# EAGLE design OhBaby10-1 (EAGLE 9.4.2)
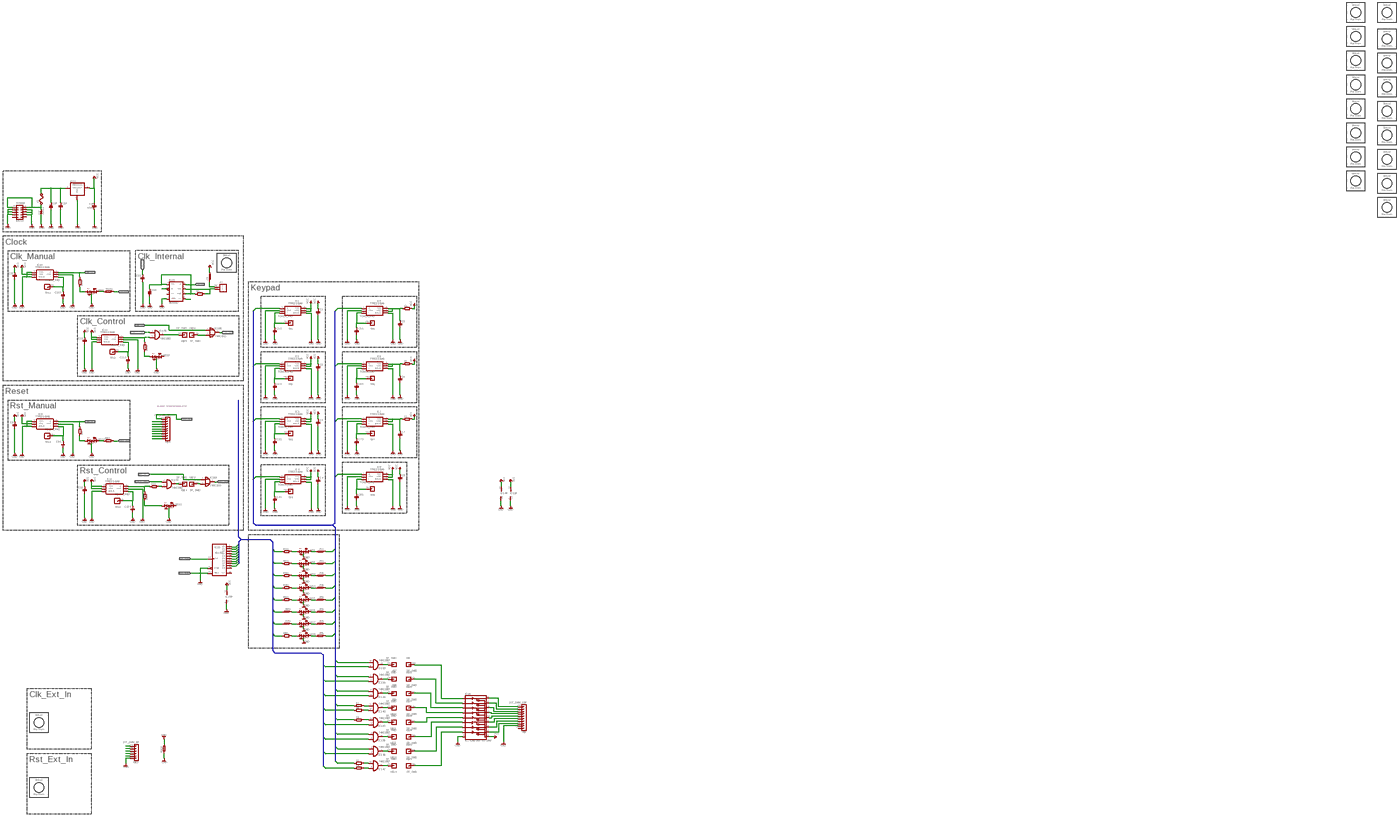
[diagram p0: schematic, sheet 1, overview]
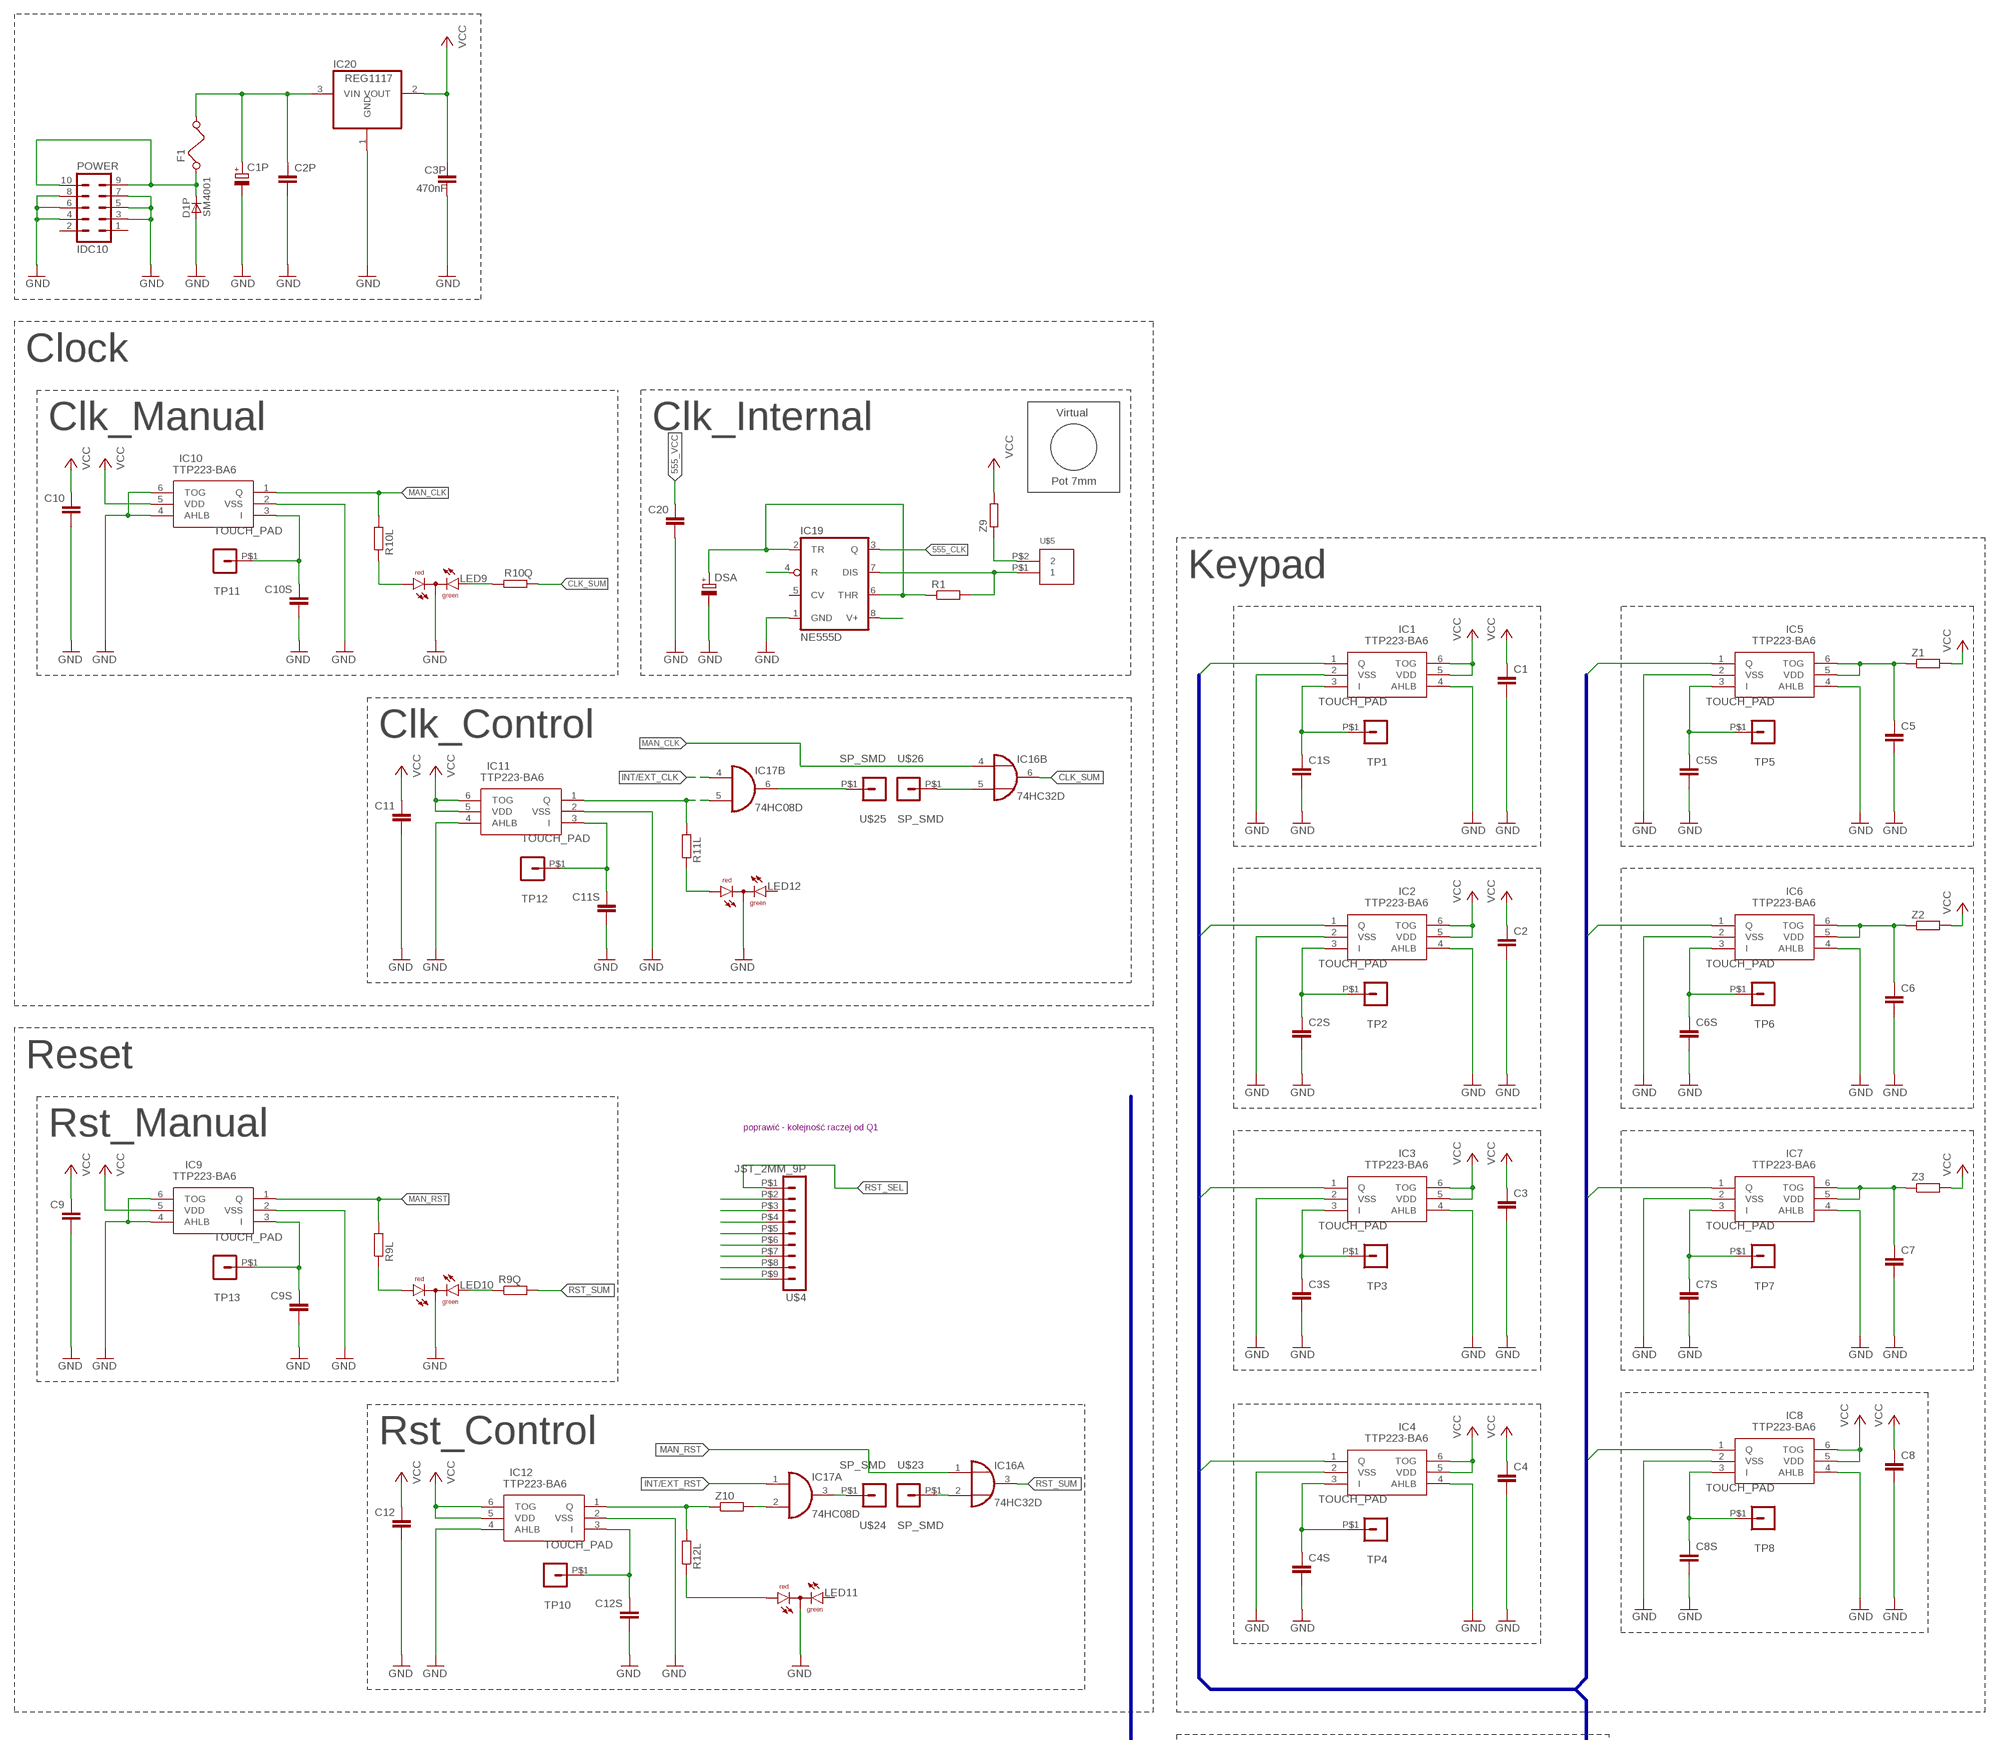
[diagram p1: schematic, sheet 1, part 1 of 5]
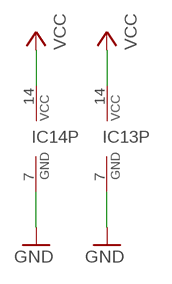
[diagram p2: schematic, sheet 1, part 2 of 5]
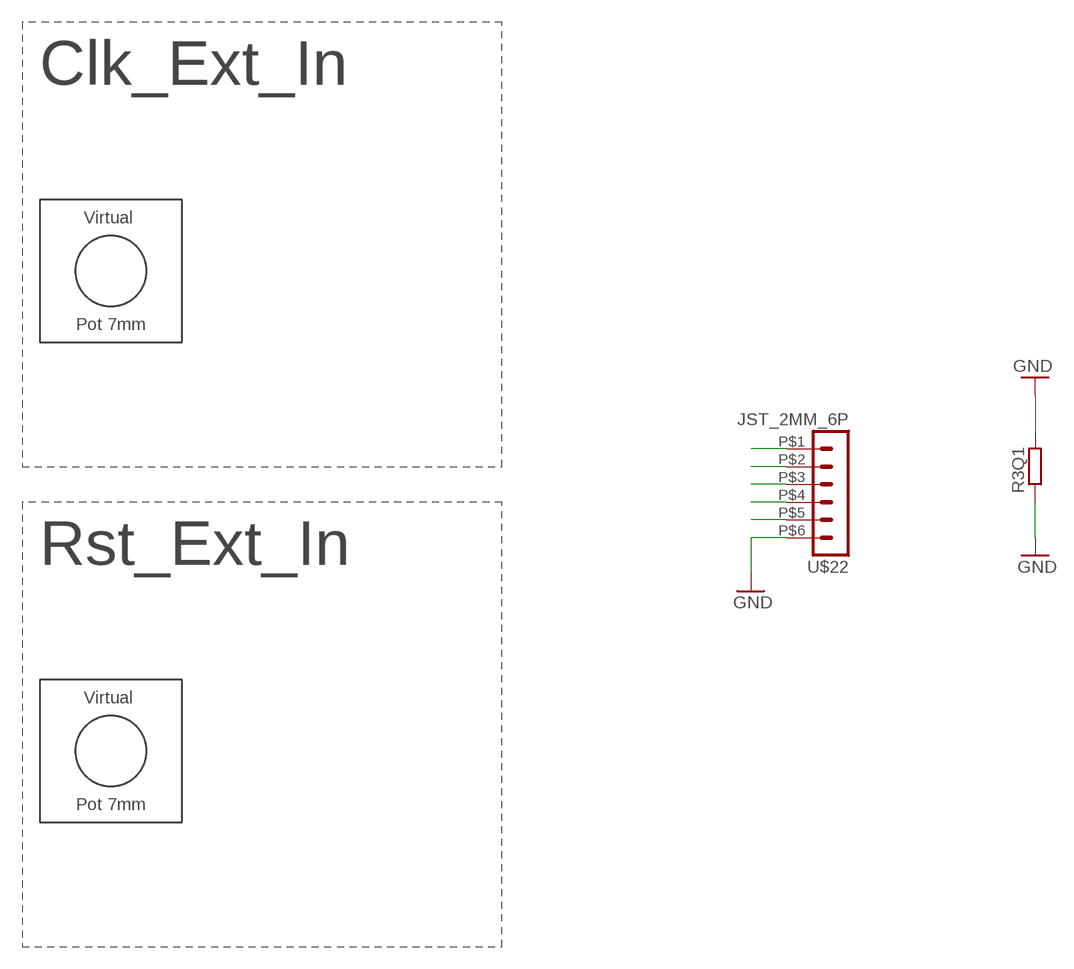
[diagram p3: schematic, sheet 1, part 3 of 5]
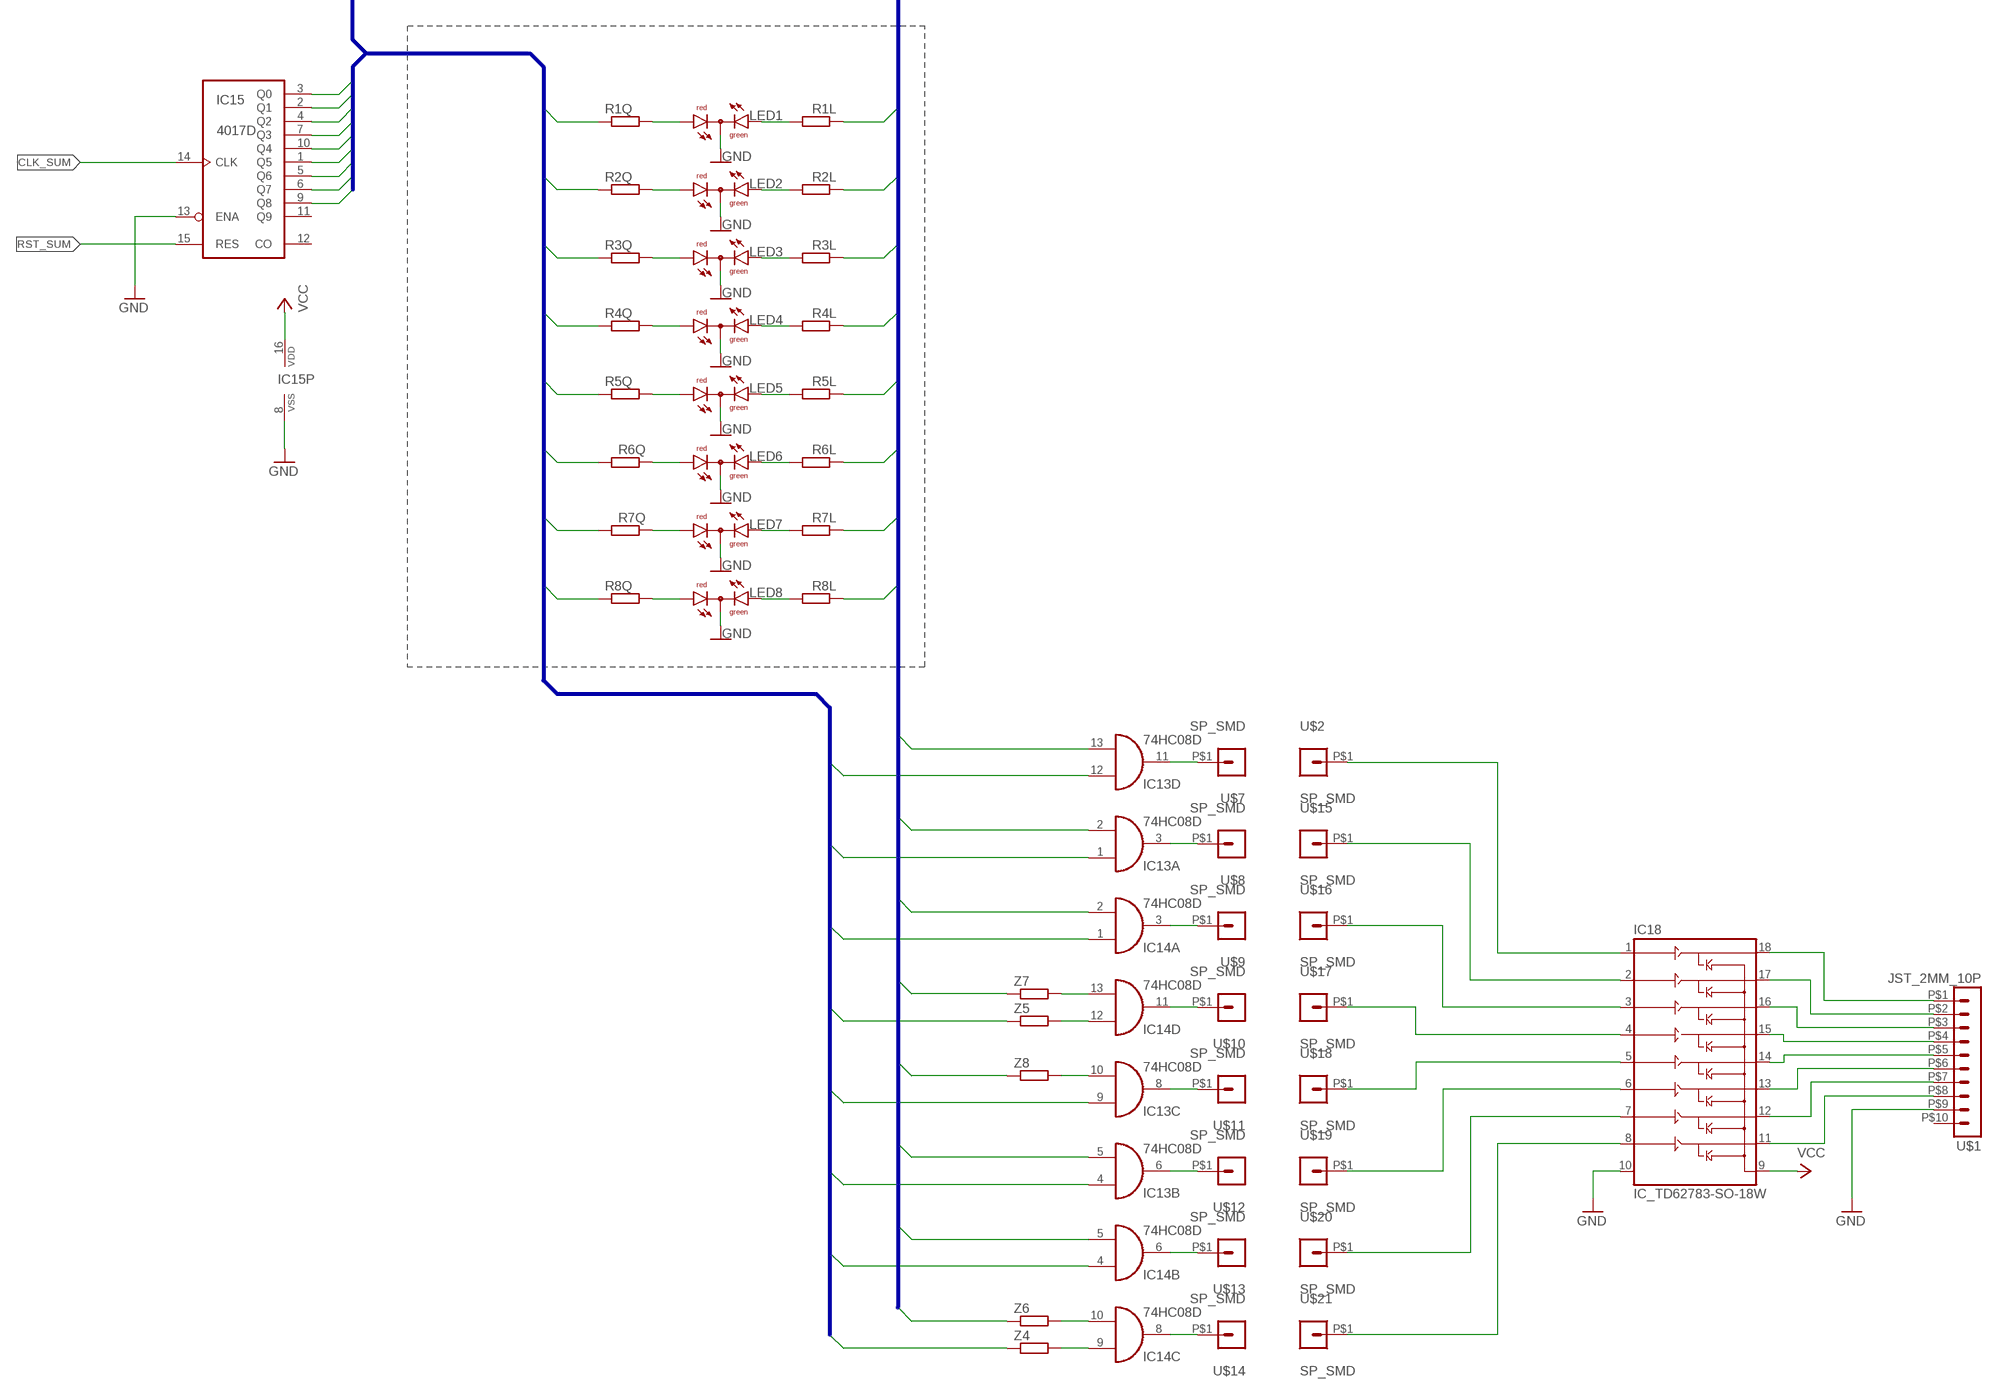
[diagram p4: schematic, sheet 1, part 4 of 5]
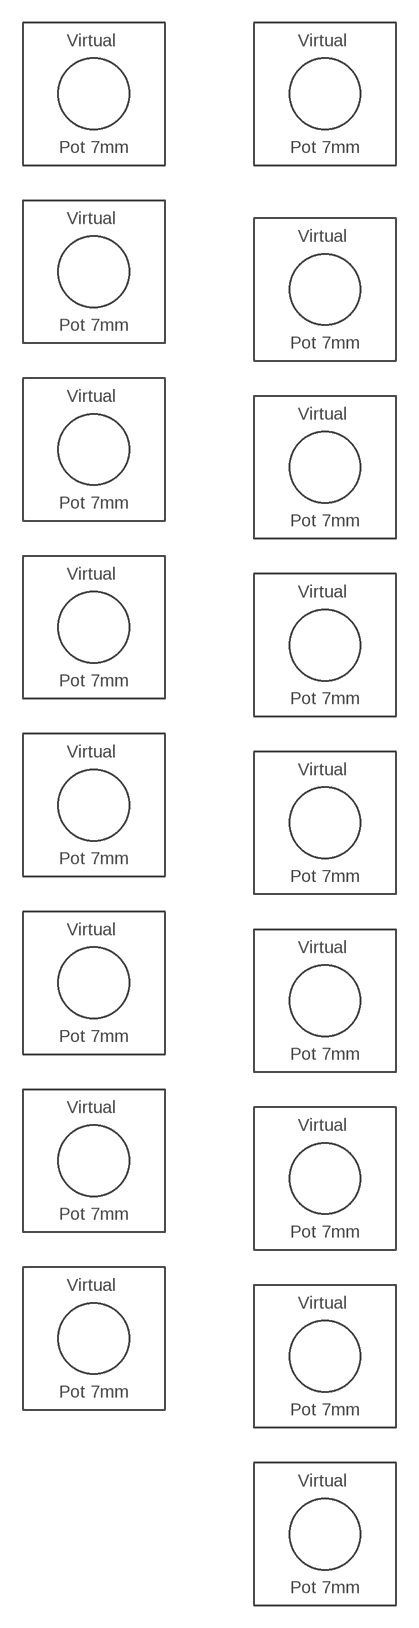
[diagram p5: schematic, sheet 1, part 5 of 5]

## Parts
C1  C-EUC0805  [C0805]
C1P  CPOL-EU153CLV-0405  [153CLV-0405]
C1S  C-EUC0805  [C0805]
C2  C-EUC0805  [C0805]
C2P  C-EUC0805K  [C0805K]
C2S  C-EUC0805  [C0805]
C3  C-EUC0805  [C0805]
C3P  470nF  C-EUC0805  [C0805]
C3S  C-EUC0805  [C0805]
C4  C-EUC0805  [C0805]
C4S  C-EUC0805  [C0805]
C5  C-EUC0805  [C0805]
C5S  C-EUC0805  [C0805]
C6  C-EUC0805  [C0805]
C6S  C-EUC0805  [C0805]
C7  C-EUC0805  [C0805]
C7S  C-EUC0805  [C0805]
C8  C-EUC0805  [C0805]
C8S  C-EUC0805  [C0805]
C9  C-EUC0805  [C0805]
C9S  C-EUC0805  [C0805]
C10  C-EUC0805  [C0805]
C10S  C-EUC0805  [C0805]
C11  C-EUC0805  [C0805]
C11S  C-EUC0805  [C0805]
C12  C-EUC0805  [C0805]
C12S  C-EUC0805  [C0805]
C20  C-EUC0805  [C0805]
CV_OUT  JACK3.5  [JACK_FANCY]
D1P  SM4001  [MELF-MLL41_DO213AB]
DSA  CPOL-EU153CLV-0405  [153CLV-0405]
EXT_CLK_IN  JACK3.5  [JACK_FANCY]
EXT_CLK_IN1  JACK3.5  [JACK_FANCY]
F1  FUSEB  [0805]
IC1  TTP223-BA6  [SOT95P285X126-6N]
IC2  TTP223-BA6  [SOT95P285X126-6N]
IC3  TTP223-BA6  [SOT95P285X126-6N]
IC4  TTP223-BA6  [SOT95P285X126-6N]
IC5  TTP223-BA6  [SOT95P285X126-6N]
IC6  TTP223-BA6  [SOT95P285X126-6N]
IC7  TTP223-BA6  [SOT95P285X126-6N]
IC8  TTP223-BA6  [SOT95P285X126-6N]
IC9  TTP223-BA6  [SOT95P285X126-6N]
IC10  TTP223-BA6  [SOT95P285X126-6N]
IC11  TTP223-BA6  [SOT95P285X126-6N]
IC12  TTP223-BA6  [SOT95P285X126-6N]
IC13  74HC08D  [SO14]
IC14  74HC08D  [SO14]
IC15  4017D  [SO16]
IC16  74HC32D  [SO14]
IC17  74HC08D  [SO14]
IC18  IC_TD62783-SO-18W  [SO-18L]
IC19  NE555D  [SO08]
IC20  REG1117  [SOT223]
LED1  LED_3PIN  [LED_3PIN_SMD]
LED2  LED_3PIN  [LED_3PIN_SMD]
LED3  LED_3PIN  [LED_3PIN_SMD]
LED4  LED_3PIN  [LED_3PIN_SMD]
LED5  LED_3PIN  [LED_3PIN_SMD]
LED6  LED_3PIN  [LED_3PIN_SMD]
LED7  LED_3PIN  [LED_3PIN_SMD]
LED8  LED_3PIN  [LED_3PIN_SMD]
LED9  LED_3PIN  [LED_3PIN_SMD]
LED10  LED_3PIN  [LED_3PIN_SMD]
LED11  LED_3PIN  [LED_3PIN_SMD]
LED12  LED_3PIN  [LED_3PIN_SMD]
OUT_S1  JACK3.5  [JACK_FANCY]
OUT_S2  JACK3.5  [JACK_FANCY]
OUT_S3  JACK3.5  [JACK_FANCY]
OUT_S4  JACK3.5  [JACK_FANCY]
OUT_S5  JACK3.5  [JACK_FANCY]
OUT_S6  JACK3.5  [JACK_FANCY]
OUT_S7  JACK3.5  [JACK_FANCY]
OUT_S8  JACK3.5  [JACK_FANCY]
POT_S1  V_POT  [POT_FANCY]
POT_S2  V_POT  [POT_FANCY]
POT_S3  V_POT  [POT_FANCY]
POT_S4  V_POT  [POT_FANCY]
POT_S5  V_POT  [POT_FANCY]
POT_S6  V_POT  [POT_FANCY]
POT_S7  V_POT  [POT_FANCY]
POT_S8  V_POT  [POT_FANCY]
POWER  IDC10  [ML10]
R1  R-EU_R1206  [R1206]
R1L  R-EU_R0805  [R0805]
R1Q  R-EU_R1206  [R1206]
R2L  R-EU_R0805  [R0805]
R2Q  R-EU_R1206  [R1206]
R3L  R-EU_R0805  [R0805]
R3Q  R-EU_R1206  [R1206]
R3Q1  R-EU_R1206  [R1206]
R4L  R-EU_R0805  [R0805]
R4Q  R-EU_R1206  [R1206]
R5L  R-EU_R0805  [R0805]
R5Q  R-EU_R1206  [R1206]
R6L  R-EU_R0805  [R0805]
R6Q  R-EU_R0805  [R0805]
R7L  R-EU_R0805  [R0805]
R7Q  R-EU_R0805  [R0805]
R8L  R-EU_R0805  [R0805]
R8Q  R-EU_R1206  [R1206]
R9L  R-EU_R0805  [R0805]
R9Q  R-EU_R1206  [R1206]
R10L  R-EU_R0805  [R0805]
R10Q  R-EU_R0805  [R0805]
R11L  R-EU_R0805  [R0805]
R12L  R-EU_R0805  [R0805]
TP1  TOUCH_PAD  [TOUCH_PAD_8X8]
TP2  TOUCH_PAD  [TOUCH_PAD_8X8]
TP3  TOUCH_PAD  [TOUCH_PAD_8X8]
TP4  TOUCH_PAD  [TOUCH_PAD_8X8]
TP5  TOUCH_PAD  [TOUCH_PAD_8X8]
TP6  TOUCH_PAD  [TOUCH_PAD_8X8]
TP7  TOUCH_PAD  [TOUCH_PAD_8X8]
TP8  TOUCH_PAD  [TOUCH_PAD_8X8]
TP10  TOUCH_PAD  [TOUCH_PAD_8X8]
TP11  TOUCH_PAD  [TOUCH_PAD_8X8]
TP12  TOUCH_PAD  [TOUCH_PAD_8X8]
TP13  TOUCH_PAD  [TOUCH_PAD_8X8]
U$1  JST_2MM_10P  [JST_2MM_10P]
U$2  SP_SMD  [SINGLE_PAD_SMD]
U$4  JST_2MM_9P  [JST_2MM_9P]
U$5  JST_2MM_2P  [JST_2MM_2P]
U$6  V_POT  [POT_FANCY]
U$7  SP_SMD  [SINGLE_PAD_SMD]
U$8  SP_SMD  [SINGLE_PAD_SMD]
U$9  SP_SMD  [SINGLE_PAD_SMD]
U$10  SP_SMD  [SINGLE_PAD_SMD]
U$11  SP_SMD  [SINGLE_PAD_SMD]
U$12  SP_SMD  [SINGLE_PAD_SMD]
U$13  SP_SMD  [SINGLE_PAD_SMD]
U$14  SP_SMD  [SINGLE_PAD_SMD]
U$15  SP_SMD  [SINGLE_PAD_SMD]
U$16  SP_SMD  [SINGLE_PAD_SMD]
U$17  SP_SMD  [SINGLE_PAD_SMD]
U$18  SP_SMD  [SINGLE_PAD_SMD]
U$19  SP_SMD  [SINGLE_PAD_SMD]
U$20  SP_SMD  [SINGLE_PAD_SMD]
U$21  SP_SMD  [SINGLE_PAD_SMD]
U$22  JST_2MM_6P  [JST_2MM_6P]
U$23  SP_SMD  [SINGLE_PAD_SMD]
U$24  SP_SMD  [SINGLE_PAD_SMD]
U$25  SP_SMD  [SINGLE_PAD_SMD]
U$26  SP_SMD  [SINGLE_PAD_SMD]
Z1  R-EU_R1206  [R1206]
Z2  R-EU_R1206  [R1206]
Z3  R-EU_R2010  [R2010]
Z4  R-EU_R2010  [R2010]
Z5  R-EU_R2010  [R2010]
Z6  R-EU_R2010  [R2010]
Z7  R-EU_R2010  [R2010]
Z8  R-EU_R1206  [R1206]
Z9  R-EU_R1206  [R1206]
Z10  R-EU_R2010  [R2010]

## Nets
555_CLK: IC19.3(Q) U$22.P$2
555_VCC: C20.1 IC19.4(R) IC19.8(V+) U$5.P$2 Z9.1
4017_Q0: IC13.12(D:I0) IC15.3(Q0) R1Q.1
4017_Q1: IC13.1(A:I0) IC15.2(Q1) R2Q.1 U$4.P$8
4017_Q2: IC14.1(A:I0) IC15.4(Q2) R3Q.1 U$4.P$7
4017_Q3: IC15.7(Q3) R4Q.1 U$4.P$4 Z5.1
4017_Q4: IC13.9(C:I0) IC15.10(Q4) R5Q.1 U$4.P$3
4017_Q5: IC13.4(B:I0) IC15.1(Q5) R6Q.2 U$4.P$9
4017_Q6: IC14.4(B:I0) IC15.5(Q6) R7Q.2 U$4.P$6
4017_Q7: IC15.6(Q7) R8Q.1 U$4.P$5 Z4.1
4017_Q8: IC15.9(Q8) U$4.P$2
+12V_PWR: D1P.C F1.1 POWER.9 POWER.10
CLK_SUM: IC15.14(CLK) IC16.6(B:O) R10Q.1
GND: C1.2 C1P.- C1S.2 C2.2 C2P.2 C2S.2 C3.2 C3P.2 C3S.2 C4.2 C4S.2 C5.2 C5S.2 C6.2 C6S.2 C7.2 C7S.2 C8.2 C8S.2 C9.2 C9S.2 C10.2 C10S.2 C11.2 C11S.2 C12.2 C12S.2 C20.2 D1P.A DSA.- IC1.2(VSS) IC1.4(AHLB) IC2.2(VSS) IC2.4(AHLB) IC3.2(VSS) IC3.4(AHLB) IC4.2(VSS) IC4.4(AHLB) IC5.2(VSS) IC5.4(AHLB) IC6.2(VSS) IC6.4(AHLB) IC7.2(VSS) IC7.4(AHLB) IC8.2(VSS) IC8.4(AHLB) IC9.2(VSS) IC9.4(AHLB) IC9.6(TOG) IC10.2(VSS) IC10.4(AHLB) IC10.6(TOG) IC11.2(VSS) IC11.4(AHLB) IC12.2(VSS) IC12.4(AHLB) IC13.7(P:GND) IC14.7(P:GND) IC15.8(VSS) IC15.13(ENA) IC18.10(VS) IC19.1(GND) IC20.1(GND) LED1.P$1(C) LED2.P$1(C) LED3.P$1(C) LED4.P$1(C) LED5.P$1(C) LED6.P$1(C) LED7.P$1(C) LED8.P$1(C) LED9.P$1(C) LED10.P$1(C) LED11.P$1(C) LED12.P$1(C) POWER.3 POWER.4 POWER.5 POWER.6 POWER.7 POWER.8 R3Q1.1 R3Q1.2 U$1.P$9 U$22.P$6
INT/EXT_CLK: IC17.4(B:I0) U$22.P$4
INT/EXT_RST: IC17.1(A:I0) U$22.P$3
KEY1: IC1.1(Q) IC13.13(D:I1) R1L.1
KEY2: IC2.1(Q) IC13.2(A:I1) R2L.1
KEY3: IC3.1(Q) IC14.2(A:I1) R3L.1
KEY4: IC4.1(Q) R4L.1 Z7.1
KEY5: IC5.1(Q) R5L.1 Z8.1
KEY6: IC6.1(Q) IC13.5(B:I1) R6L.1
KEY7: IC7.1(Q) IC14.5(B:I1) R7L.1
KEY8: IC8.1(Q) R8L.1 Z6.1
KEY11: IC11.1(Q) IC17.5(B:I1) R11L.2
MAN_CLK: IC10.1(Q) IC16.4(B:I0) R10L.2
MAN_RST: IC9.1(Q) IC16.1(A:I0) R9L.2
N$1: DSA.+ IC19.2(TR) IC19.6(THR) R1.1
N$2: C10S.1 IC10.3(I) TP11.P$1
N$3: IC19.7(DIS) R1.2 U$5.P$1
N$4: LED9.P$2(AR) R10L.1
N$5: C1S.1 IC1.3(I) TP1.P$1
N$6: C11S.1 IC11.3(I) TP12.P$1
N$7: LED12.P$2(AR) R11L.1
N$8: C9S.1 IC9.3(I) TP13.P$1
N$9: LED1.P$2(AR) R1Q.2
N$10: C5S.1 IC5.3(I) TP5.P$1
N$11: IC16.5(B:I1) U$26.P$1
N$12: LED10.P$2(AR) R9L.1
N$13: LED1.P$3(AG) R1L.2
N$14: LED2.P$2(AR) R2Q.2
N$15: LED9.P$3(AG) R10Q.2
N$16: LED2.P$3(AG) R2L.2
N$17: C2S.1 IC2.3(I) TP2.P$1
N$18: IC16.2(A:I1) U$23.P$1
N$19: LED3.P$2(AR) R3Q.2
N$20: LED3.P$3(AG) R3L.2
N$21: C12S.1 IC12.3(I) TP10.P$1
N$22: LED4.P$2(AR) R4Q.2
N$23: LED11.P$2(AR) R12L.1
N$24: LED4.P$3(AG) R4L.2
N$25: LED5.P$2(AR) R5Q.2
N$26: C3S.1 IC3.3(I) TP3.P$1
N$27: LED5.P$3(AG) R5L.2
N$28: LED6.P$2(AR) R6Q.1
N$29: LED6.P$3(AG) R6L.2
N$30: LED7.P$2(AR) R7Q.1
N$31: C4S.1 IC4.3(I) TP4.P$1
N$32: LED7.P$3(AG) R7L.2
N$33: LED8.P$2(AR) R8Q.2
N$34: IC17.3(A:O) U$24.P$1
N$35: IC17.6(B:O) U$25.P$1
N$36: U$22.P$5
N$37: IC17.2(A:I1) Z10.2
N$42: LED8.P$3(AG) R8L.2
N$43: IC18.14(OUT5) U$1.P$5
N$44: IC18.13(OUT6) U$1.P$6
N$45: IC18.12(OUT7) U$1.P$7
N$46: IC18.11(OUT8) U$1.P$8
N$47: IC18.15(OUT4) U$1.P$4
N$48: IC18.16(OUT3) U$1.P$3
N$49: C6S.1 IC6.3(I) TP6.P$1
N$50: IC18.17(OUT2) U$1.P$2
N$51: IC18.18(OUT1) U$1.P$1
N$52: LED10.P$3(AG) R9Q.1
N$53 [power]: C1P.+ C2P.1 F1.2 IC20.3(VIN)
N$54: C7S.1 IC7.3(I) TP7.P$1
N$55: IC13.11(D:O) U$7.P$1
N$56: IC13.3(A:O) U$8.P$1
N$59: C8S.1 IC8.3(I) TP8.P$1
N$60: IC14.3(A:O) U$9.P$1
N$61: IC14.11(D:O) U$10.P$1
N$62: IC13.8(C:O) U$11.P$1
N$63: IC13.6(B:O) U$12.P$1
N$64: IC14.6(B:O) U$13.P$1
N$65: IC14.8(C:O) U$14.P$1
N$67: IC14.9(C:I0) Z4.2
N$68: IC14.10(C:I1) Z6.2
N$69: IC14.12(D:I0) Z5.2
N$70: IC14.13(D:I1) Z7.2
N$71: C5.1 IC5.5(VDD) IC5.6(TOG) Z1.1
N$72: C6.1 IC6.5(VDD) IC6.6(TOG) Z2.1
N$73: C7.1 IC7.5(VDD) IC7.6(TOG) Z3.1
N$74: IC13.10(C:I1) Z8.2
N$75: IC18.1(IN1) U$2.P$1
N$76: IC18.2(IN2) U$15.P$1
N$77: IC18.3(IN3) U$16.P$1
N$78: IC18.4(IN4) U$17.P$1
N$79: IC18.5(IN5) U$18.P$1
N$80: IC18.6(IN6) U$19.P$1
N$81: IC18.7(IN7) U$20.P$1
N$82: IC18.8(IN8) U$21.P$1
RS_EXT_ENABLE: IC12.1(Q) R12L.2 Z10.1
RST_SEL: U$4.P$1 U$22.P$1
RST_SUM: IC15.15(RES) IC16.3(A:O) R9Q.2
VCC: C1.1 C2.1 C3.1 C3P.1 C4.1 C8.1 C9.1 C10.1 C11.1 C12.1 IC1.5(VDD) IC1.6(TOG) IC2.5(VDD) IC2.6(TOG) IC3.5(VDD) IC3.6(TOG) IC4.5(VDD) IC4.6(TOG) IC8.5(VDD) IC8.6(TOG) IC9.5(VDD) IC10.5(VDD) IC11.5(VDD) IC11.6(TOG) IC12.5(VDD) IC12.6(TOG) IC13.14(P:VCC) IC14.14(P:VCC) IC15.16(VDD) IC18.9(GND) IC20.2(VOUT) Z1.2 Z2.2 Z3.2 Z9.2
Unconnected: IC15.11(Q9) IC15.12(CO) IC16.8(C:O) IC16.9(C:I0) IC16.10(C:I1) IC16.11(D:O) IC16.12(D:I0) IC16.13(D:I1) IC17.8(C:O) IC17.9(C:I0) IC17.10(C:I1) IC17.11(D:O) IC17.12(D:I0) IC17.13(D:I1) IC19.5(CV) LED11.P$3(AG) LED12.P$3(AG) POWER.1 POWER.2 U$1.P$10

## Buses
4017_Q[0..9]
KEY[1..10]

## Notes on the sheet
- Clock
- Clk_Manual | Clk_Internal
- Keypad
- Clk_Control
- Reset
- Rst_Manual
- poprawić - kolejność raczej od Q1
- Rst_Control
- Clk_Ext_In
- Rst_Ext_In

## Power pins joined to a net without a drawn wire
GND: IC16.7(P:GND) IC17.7(P:GND)
VCC: IC16.14(P:VCC) IC17.14(P:VCC)

## Library data of the parts
C1 C1S C2 C2P C2S C3 C3P C3S C4 C4S C5 C5S C6 C6S C7 C7S C8 C8S C9 C9S C10 C10S C11 C11S C12 C12S C20 = rcl:C-EU: CAPACITOR, European symbol; SPICEPREFIX: C
C1P DSA = rcl:CPOL-EU: POLARIZED CAPACITOR, European symbol; SPICEPREFIX: C
CV_OUT EXT_CLK_IN EXT_CLK_IN1 OUT_S1-OUT_S8 = custom_jatsekku:JACK3.5
D1P = hhn_diodes_smd:SM400*: SM4001 .. SM4007 General Purpose Rectifier, 1 A SMD-Version of 1N4001 .. 1N4007 Case: MELF-MLL41 = DO 213 AB Author: Dipl.-Ing. FH Rainer Bayer HHN Hochschule Heilbronn, rainer.bayer@hs-heilbronn.de Ingenieurbüro ing-rb, mail@ing-rb.de
F1 = m-pad-2.1:FUSE: Fuse's in various packages
IC1-IC12 = TTP223-BA6:TTP223-BA6: 1 KEY TOUCH PAD DETECTOR IC Source: Datasheet <https://radiokot.ru/konkursCatDay2014/53/01.pdf>; DESCRIPTION: 1 KEY TOUCH PAD DETECTOR IC; HEIGHT: 1.26mm; MANUFACTURER_NAME: TONTEK; MANUFACTURER_PART_NUMBER: TTP223-BA6
IC13 IC14 IC17 = 74xx-eu:74*08: Quad 2-input AND gate
IC15 = 40xx:4017: COUNTER/DIVIDER
IC16 = 74xx-eu:74*32: Quad 2-input OR gate
IC18 = dp_devices:IC_TD62783: 8 Channel High voltage Source driver Mfr no: TD62783 TD62783AFG <http://www.digikey.com/product-detail/en/TD62783AFG%28O,S%29/TD62783AFG%28OS%29-ND/871116>
IC19 = linear:*555: TIMER
IC20 = burr-brown:REG1117: 800mA and 1A Low Dropout (LDO) Positive Regulator 1.8V, 2.5V, 2.85V, 3.3V, 5V, and Adj; MPN: REG1117; OC_FARNELL: 1097566; OC_NEWARK: 14P6981
LED1-LED12 = custom_jatsekku:LED_3PIN
POT_S1-POT_S8 U$6 = custom_jatsekku:V_POT
POWER = custom_jatsekku:IDC10
R1 R1L R1Q R2L R2Q R3L R3Q R3Q1 R4L R4Q R5L R5Q R6L R6Q R7L R7Q R8L R8Q R9L R9Q R10L R10Q R11L R12L Z1-Z10 = rcl:R-EU_: RESISTOR, European symbol; SPICEPREFIX: R
TP1-TP8 TP10-TP13 = custom_jatsekku:TOUCH_PAD
U$1 = custom_jatsekku:JST_2MM_10P
U$2 U$7-U$21 U$23-U$26 = custom_jatsekku:SP_SMD
U$4 = custom_jatsekku:JST_2MM_9P
U$5 = custom_jatsekku:JST_2MM_2P
U$22 = custom_jatsekku:JST_2MM_6P

## Board
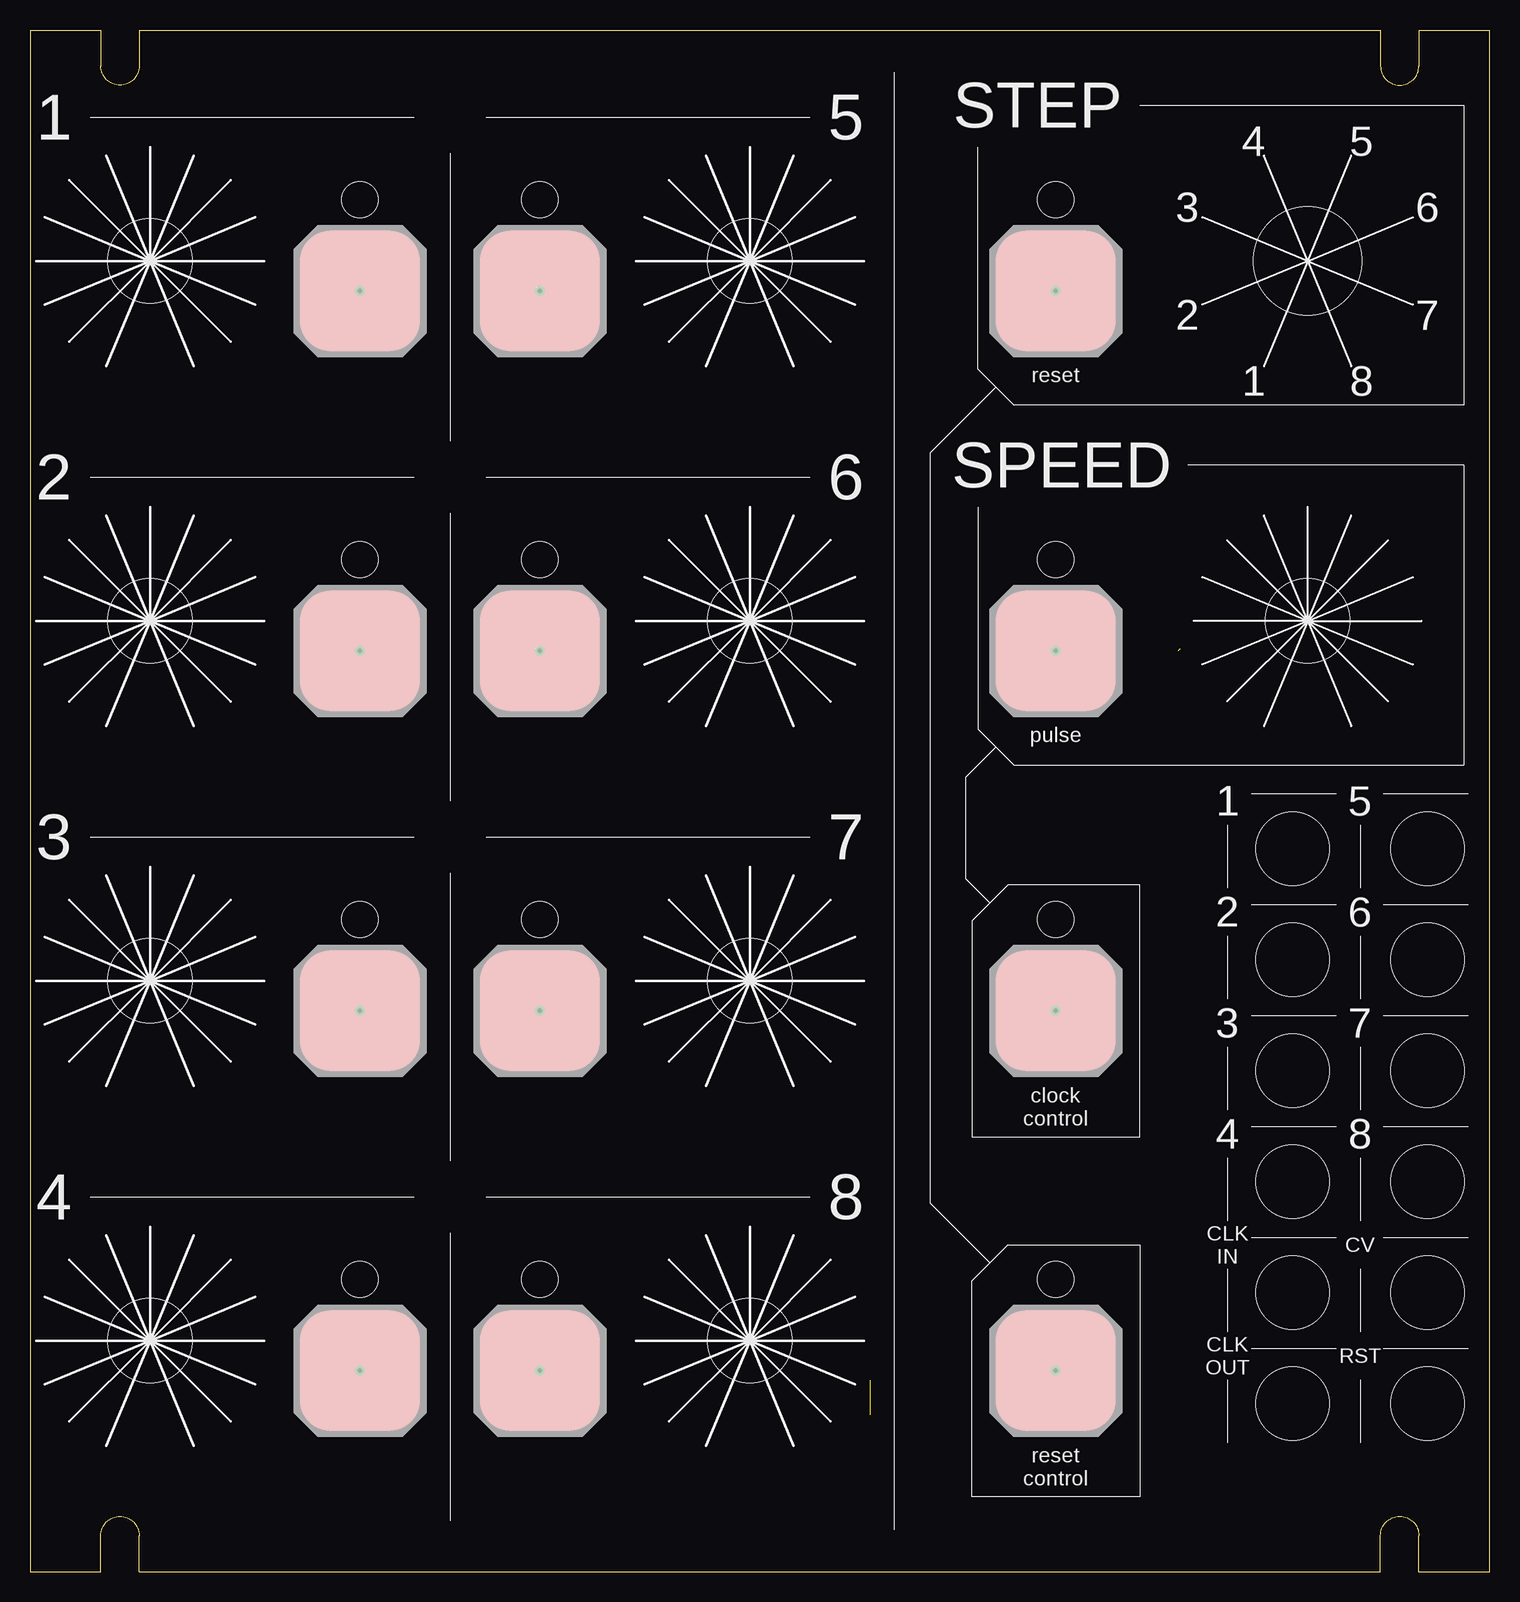
[diagram p6: board, top side]
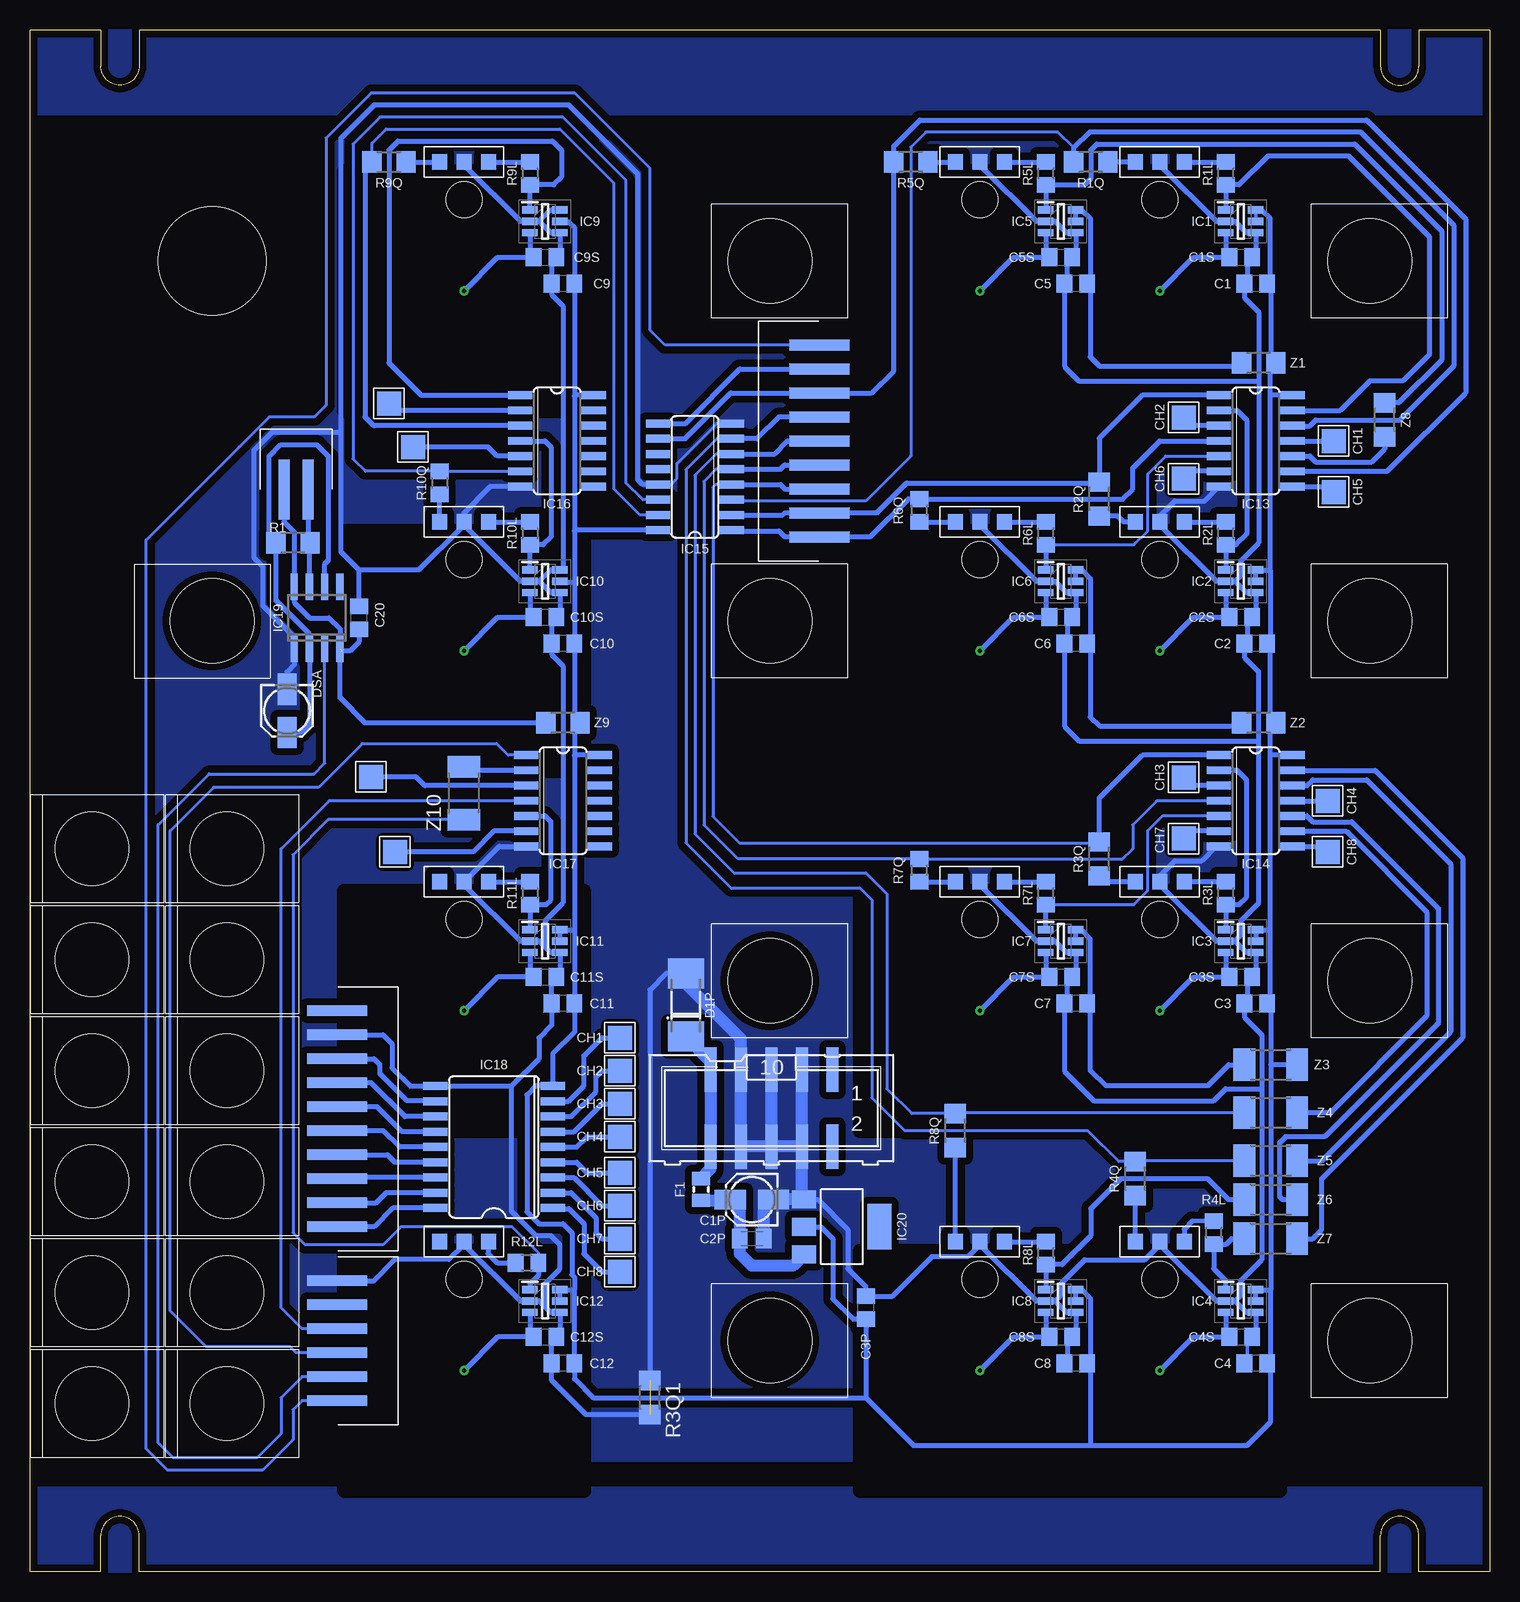
[diagram p7: board, bottom side, seen from below]

Size 121.68 x 128.5 mm. Coordinates in mm from the lower left corner, seen from the top.
Outline: 0,0 5.9,0 5.9,3 arc-180 9.1,3 9.1,0 112.58,0 112.58,3 arc-180 115.78,3 115.78,0 121.68,0 121.68,128.5 115.78,128.5 115.78,125.5 arc-180 112.58,125.5 112.58,128.5 9.1,128.5 9.1,125.5 arc-180 5.9,125.5 5.9,128.5 0,128.5 0,0
Copper layers (1*16): Top 0.035mm / dielectric 1.5mm / Bottom 0.035mm
Design rules "default *": minimum track width 3.5mil, minimum drill 0.2mm, track to track 6mil, track to pad 6mil, pad to pad 6mil, via to via 6mil, smd to smd 6mil, copper to edge 5mil, drill to drill 6mil, minimum pad ring 10mil, minimum via ring 8mil, stop-mask expansion 4mil, vias tented up to drill 0mil, thermal gap 10mil
Holes 3 mm at 27.5,114.35 42.5,114.35 27.5,84.35 42.5,84.35 27.5,54.35 42.5,54.35 27.5,24.35 42.5,24.35 85.5,84.35 85.5,114.35 85.5,54.35 85.5,24.35
Holes 9 mm at 106.5,109.25
bRestrict: area 17.5,96.8 to 52.5,116.8; area 17.5,66.8 to 52.5,86.8; area 17.5,36.8 to 52.5,56.8; area 17.5,6.8 to 52.5,26.8; area 75.5,96.8 to 95.5,116.8; area 75.5,66.8 to 95.5,86.8; area 75.5,36.8 to 95.5,56.8; area 75.5,6.8 to 95.5,26.8

### Footprints (pad centres in the part's own frame; a part is rotated, then mirrored left to right if it is on the bottom)
C0805 = smd 1.3 x 1.5: 1 -0.95,0; 2 0.95,0
153CLV-0405 = smd 2.6 x 1.6: + 1.8,0; - -1.8,0
C0805K = smd 1.3 x 1.6: 1 -1,0; 2 1,0
JACK_FANCY = hole 6.1: 0,0
MELF-MLL41_DO213AB = smd 2.5 x 3: A 2.625,0; C -2.625,0
0805 = smd 1.1 x 1.5: 1 -0.9,0; 2 0.9,0
SOT95P285X126-6N = smd 1.3 x 0.6: 1 -1.25,0.95; 2 -1.25,0; 3 -1.25,-0.95; 4 1.25,-0.95; 5 1.25,0; 6 1.25,0.95
SO14 = smd 0.66 x 2.032: 1 -3.81,-3.073; 2 -2.54,-3.073; 3 -1.27,-3.073; 4 0,-3.073; 5 1.27,-3.073; 6 2.54,-3.073; 7 3.81,-3.073; 8 3.81,3.073; 9 2.54,3.073; 10 1.27,3.073; 11 0,3.073; 12 -1.27,3.073; 13 -2.54,3.073; 14 -3.81,3.073
SO16 = smd 0.66 x 2.032: 1 -4.445,-3.073; 2 -3.175,-3.073; 3 -1.905,-3.073; 4 -0.635,-3.073; 5 0.635,-3.073; 6 1.905,-3.073; 7 3.175,-3.073; 8 4.445,-3.073; 9 4.445,3.073; 10 3.175,3.073; 11 1.905,3.073; 12 0.635,3.073; 13 -0.635,3.073; 14 -1.905,3.073; 15 -3.175,3.073; 16 -4.445,3.073
SO-18L = smd 0.66 x 2.032: 1 -4.445,-4.902; 2 -3.175,-4.902; 3 -1.905,-4.902; 4 -0.635,-4.902; 5 0.635,-4.902; 6 1.905,-4.902; 7 3.175,-4.902; 8 4.445,-4.902; 9 5.715,-4.902; 10 5.715,4.902; 11 4.445,4.902; 12 3.175,4.902; 13 1.905,4.902; 14 0.635,4.902; 15 -0.635,4.902; 16 -1.905,4.902; 17 -3.175,4.902; 18 -4.445,4.902
SO08 = smd 0.6 x 2.2: 1 -1.905,-2.6; 2 -0.635,-2.6; 3 0.635,-2.6; 4 1.905,-2.6; 5 1.905,2.6; 6 0.635,2.6; 7 -0.635,2.6; 8 -1.905,2.6
SOT223 = smd 1.499 x 2.007: 1 -2.261,-3.15; 2 0.025,-3.15; 3 2.311,-3.15 | smd 3.81 x 2.007: 4 0,3.15
LED_3PIN_SMD = smd 1.27 x 1.27: P$1 0,0; P$2 -2.04,0; P$3 2.04,0
POT_FANCY = hole 7: 0,0
ML10 = smd 1.02 x 3.7: 1 -5.08,-3.2; 2 -5.08,3.2; 3 -2.54,-3.2; 4 -2.54,3.2; 5 0,-3.2; 6 0,3.2; 7 2.54,-3.2; 8 2.54,3.2; 9 5.08,-3.2; 10 5.08,3.2
R1206 = smd 1.6 x 1.803: 1 -1.422,0; 2 1.422,0
R0805 = smd 1.3 x 1.5: 1 -0.95,0; 2 0.95,0
TOUCH_PAD_8X8 = smd 10 x 10: P$1 0,0
JST_2MM_10P = smd 0.914 x 5: P$1 -9,5.08; P$2 -7,5.08; P$3 -5,5.08; P$4 -3,5.08; P$5 -1,5.08; P$6 1,5.08; P$7 3,5.08; P$8 5,5.08; P$9 7,5.08; P$10 9,5.08
SINGLE_PAD_SMD = smd 2 x 2: P$1 0,0
JST_2MM_9P = smd 0.914 x 5: P$1 -7.73,5.08; P$2 -5.73,5.08; P$3 -3.73,5.08; P$4 -1.73,5.08; P$5 0.27,5.08; P$6 2.27,5.08; P$7 4.27,5.08; P$8 6.27,5.08; P$9 8.27,5.08
JST_2MM_2P = smd 0.914 x 5: P$1 -1,5.08; P$2 1,5.08
JST_2MM_6P = smd 0.914 x 5: P$1 -5,5.08; P$2 -3,5.08; P$3 -1,5.08; P$4 1,5.08; P$5 3,5.08; P$6 5,5.08
R2010 = smd 1.8 x 2.7: 1 -2.2,0; 2 2.2,0

### Placement (x,y rotation side)
C1  19.5,107.35 180 bottom
C1P  61.5,31 180 bottom
C1S  20.75,109.55 0 bottom
C2  19.5,77.35 180 bottom
C2P  61.5,27.75 0 bottom
C2S  20.75,79.55 0 bottom
C3  19.5,47.35 180 bottom
C3P  52,22 90 bottom
C3S  20.75,49.55 0 bottom
C4  19.5,17.35 180 bottom
C4S  20.75,19.55 0 bottom
C5  34.5,107.35 180 bottom
C5S  35.75,109.55 0 bottom
C6  34.5,77.35 180 bottom
C6S  35.75,79.55 0 bottom
C7  34.5,47.35 180 bottom
C7S  35.75,49.55 0 bottom
C8  34.5,17.35 180 bottom
C8S  35.75,19.55 0 bottom
C9  77.25,107.35 180 bottom
C9S  78.75,109.55 0 bottom
C10  77.25,77.35 180 bottom
C10S  78.75,79.55 0 bottom
C11  77.25,47.35 180 bottom
C11S  78.75,49.55 0 bottom
C12  77.25,17.35 180 bottom
C12S  78.75,19.55 0 bottom
C20  94.25,79.5 90 bottom
CV_OUT  105.25,23.25 90 bottom
D1P  67,47.21 90 bottom
DSA  100.25,71.75 270 bottom
EXT_CLK_IN  116.5,23.25 90 bottom
EXT_CLK_IN1  105.25,14 90 bottom
F1  65.75,31.85 270 bottom
IC1  20.75,112.55 0 bottom
IC2  20.75,82.55 0 bottom
IC3  20.75,52.55 0 bottom
IC4  20.75,22.55 0 bottom
IC5  35.75,112.55 0 bottom
IC6  35.75,82.55 0 bottom
IC7  35.75,52.55 0 bottom
IC8  35.75,22.55 0 bottom
IC9  78.75,112.55 0 bottom
IC10  78.75,82.55 0 bottom
IC11  78.75,52.55 0 bottom
IC12  78.75,22.55 0 bottom
IC13  19.5,94.25 270 bottom
IC14  19.5,64.25 270 bottom
IC15  66.25,91.25 90 bottom
IC16  77.75,94.25 270 bottom
IC17  77.25,64.25 270 bottom
IC18  83,34.75 90 bottom
IC19  97.75,79.5 0 bottom
IC20  54,28.75 270 bottom
LED1  27.5,117.5 0 bottom
LED2  27.5,87.5 0 bottom
LED3  27.5,57.5 0 bottom
LED4  27.5,27.5 0 bottom
LED5  42.5,117.5 0 bottom
LED6  42.5,87.5 0 bottom
LED7  42.5,57.5 0 bottom
LED8  42.5,27.5 0 bottom
LED9  85.5,87.5 180 bottom
LED10  85.5,117.5 180 bottom
LED11  85.5,27.5 180 bottom
LED12  85.5,57.5 180 bottom
OUT_S1  105.25,60.25 90 bottom
OUT_S2  105.25,51 90 bottom
OUT_S3  105.25,41.75 90 bottom
OUT_S4  105.25,32.5 90 bottom
OUT_S5  116.5,60.25 90 bottom
OUT_S6  116.5,51 90 bottom
OUT_S7  116.5,41.75 90 bottom
OUT_S8  116.5,32.5 90 bottom
POT_S1  10,109.25 90 bottom
POT_S2  10,79.25 90 bottom
POT_S3  10,49.25 90 bottom
POT_S4  60,109.25 90 bottom
POT_S5  60,79.25 90 bottom
POT_S6  60,49.25 90 bottom
POT_S7  60,19.25 90 bottom
POT_S8  10,19.25 90 bottom
POWER  59.88,38.62 180 bottom
R1  99.75,85.75 0 bottom
R1L  22,116.55 90 bottom
R1Q  33.25,117.5 0 bottom
R2L  22,86.55 90 bottom
R2Q  32.54,89.39 270 bottom
R3L  22,56.55 90 bottom
R3Q  32.54,59.4 270 bottom
R3Q1  70,14.5 270 bottom
R4L  23,28.25 90 bottom
R4Q  29.54,32.75 270 bottom
R5L  37,116.55 90 bottom
R5Q  48.25,117.5 0 bottom
R6L  37,86.55 90 bottom
R6Q  47.54,88.45 90 bottom
R7L  37,56.55 90 bottom
R7Q  47.54,58.45 90 bottom
R8L  37,26.55 90 bottom
R8Q  44.54,36.75 270 bottom
R9L  80,116.55 270 bottom
R9Q  91.75,117.5 180 bottom
R10L  80,86.55 270 bottom
R10Q  87.54,90.75 270 bottom
R11L  80,56.55 270 bottom
R12L  80.25,25.75 0 bottom
TP1  27.5,106.75 0 top
TP2  27.5,76.75 0 top
TP3  27.5,46.75 0 top
TP4  27.5,16.75 0 top
TP5  42.5,106.75 0 top
TP6  42.5,76.75 0 top
TP7  42.5,46.75 0 top
TP8  42.5,16.75 0 top
TP10  85.5,16.75 0 top
TP11  85.5,76.75 0 top
TP12  85.5,46.75 0 top
TP13  85.5,106.75 0 top
U$1  91,37.75 90 bottom
U$2  72.5,25 180 bottom
U$3  JACK3.5  [JACK_FANCY]  116.5,14 90 bottom
U$4  60.96,94.5 270 bottom
U$5  99.5,95.25 180 bottom
U$6  106.5,79.25 270 bottom
U$7  13,94.25 0 bottom
U$8  25.5,96.2 0 bottom
U$9  25.5,66.2 0 bottom
U$10  13.5,64.25 0 bottom
U$11  13,90 0 bottom
U$12  25.5,91.1 0 bottom
U$13  25.5,61.1 0 bottom
U$14  13.5,60 0 bottom
U$15  72.5,27.75 180 bottom
U$16  72.5,30.5 180 bottom
U$17  72.5,33.25 180 bottom
U$18  72.5,36.25 180 bottom
U$19  72.5,39 180 bottom
U$20  72.5,41.75 180 bottom
U$21  72.5,44.5 180 bottom
U$22  91,19.25 90 bottom
U$23  91.75,97.38 0 bottom
U$24  93.25,66.25 0 bottom
U$25  91.25,60 0 bottom
U$26  89.75,93.75 0 bottom
Z1  19.25,100.75 0 bottom
Z2  19.25,70.75 0 bottom
Z3  18.25,42.25 0 bottom
Z4  18.25,38.25 0 bottom
Z5  18.25,34.25 0 bottom
Z6  18.25,31 0 bottom
Z7  18.25,27.75 0 bottom
Z8  8.75,96 270 bottom
Z9  77.25,70.75 0 bottom
Z10  85.5,64.88 90 bottom

### Tracks (layer width: path | path; a pad name or v marks a point on that pad's centre or on a via)
555_CLK
  Bottom 0.254: U$22.P$2 99,16.25 100.75,14.5 100.75,11.5 102.75,9.5 109.75,9.5 111,10.75 111,62.25 106.75,66.5 98,66.5 97.11,67.39 IC19.3
555_VCC  (1 unrouted)
  Bottom 0.406: U$5.P$2 100.41,90.08 100.5,89.98 100.5,87.5 99.66,86.66 IC19.8 99.66,80.78 98.37,79.5 96.75,79.5 95.84,78.59 IC19.4 95.84,72.84 93.75,70.75 Z9.1 | C20.1 94.25,77.5 95,76.75 95.69,76.75
4017_Q0
  Bottom 0.254: 34.67,118.67 36,120 47,120 48.25,118.75 48.25,93 52,89.25 63.08,89.25
  Bottom 0.406: R1Q.1 34.67,118.67 33.34,120 10.75,120 3,112.25 3,100.5 7.5,96 14.5,96 15,95.5 16.41,95.5 IC13.12 | 63.08,89.25 IC15.3
4017_Q1
  Bottom 0.254: 58.92,88.08 58.75,88.25
  Bottom 0.406: IC13.1 28.94,98.06 32.54,94.46 R2Q.1 32.61,90.75 48.61,90.75 51.13,88.23 U$4.P$8 55.9,88.25 58.75,88.25 | IC15.2 58.92,88.08
4017_Q2
  Bottom 0.254: 32.61,60.75 62.55,60.75 64.75,62.95 64.75,90.38 64.52,90.61 IC15.4
  Bottom 0.406: IC14.1 28.94,68.06 32.54,64.46 R3Q.1 32.61,60.75 | IC15.4 59.12,90.61 58.75,90.25 55.9,90.25 U$4.P$7
4017_Q3
  Bottom 0.152: U$4.P$4 55.27,96.23 55.25,96.25
  Bottom 0.254: Z5.1 29.46,34.25 | R4Q.1 30.92,34.17 33.5,36.75 48.75,36.75 51.5,39.5 51.5,56 52.5,57 63.25,57 67,60.75 67,91.84 64.41,94.42 IC15.7
  Bottom 0.406: 29.46,34.25 R4Q.1 | 55.25,96.25 59.25,96.25 61.08,94.42 IC15.7
4017_Q4
  Bottom 0.406: IC13.9 8.54,91.71 2,98.25 2,112.75 10.25,121 47.5,121 49.67,118.83 R5Q.1 49.67,100.08 51.52,98.23 U$4.P$3 63.27,98.23 67.08,94.42 IC15.10
4017_Q5
  Bottom 0.406: IC13.4 27.5,94.25 29.75,92 29.75,90.25 30.61,89.39 R6Q.2 48.47,89.4 51.64,86.23 U$4.P$9 58.73,86.23 59.25,86.75 63.12,86.75 IC15.1
4017_Q6
  Bottom 0.254: IC14.4 27.75,64.25 29.75,62.25 29.75,60.25 30.6,59.4 R7Q.2 62.65,59.4 65.5,62.25 65.5,90.87 64.48,91.89 IC15.5
  Bottom 0.406: IC15.5 59.12,91.89 58.77,92.23 U$4.P$6
4017_Q7
  Bottom 0.254: Z4.1 44.46,38.25 | R8Q.1 48.17,38.17 50.25,40.25 50.25,56.5 52,58.25 63,58.25 66.25,61.5 66.25,91.38 64.47,93.16 IC15.6
  Bottom 0.406: 44.46,38.25 R8Q.1 | IC15.6 59.59,93.16 58.52,94.23 U$4.P$5
4017_Q8
  Bottom 0.406: IC15.9 67.06,95.69 62.52,100.23 U$4.P$2
+12V_PWR
  Bottom 0.406: 64.95,33.55 POWER.10
  Bottom 1.016: F1.1 64.95,33.55 | POWER.10 POWER.9 64.95,42.54 D1P.C
CLK_SUM
  Bottom 0.254: 87.51,91.71 IC16.6 | IC15.14 70.59,89.34 72,90.75 72,116 77.25,121.25 92.5,121.25 94.75,119 94.75,92.75 93.71,91.71 87.51,91.71 | R10Q.1 87.51,91.71
GND  (1 unrouted)
  Bottom 0.152: 19.5,49.85 C3S.2
  Bottom 0.203: LED1.P$1 27.5,117.25
  Bottom 0.254: IC15.8 64.43,95.69 67.75,92.38 67.75,91.12 68.26,90.61 IC15.13
  Bottom 0.305: C4.2 20.19,17.55 20.19,19.25 19.95,19.55 C4S.2
  Bottom 0.406: 21.23,82.55 20.28,81.6 IC2.4 19.5,79.75 19.7,79.55 C2S.2 20.19,79.16 20.19,77.61 C2.2 20.45,76.2 19.25,75 19.25,69.25 | 21.23,82.55 IC2.2 22.8,82.55 27.5,87.25 LED2.P$1 27.5,88 26.25,89.25 23.75,89.25 22.57,90.43 IC13.7 | 21.23,52.55 20.28,51.6 IC3.4 19.5,49.85 | 21.23,52.55 IC3.2 22.8,52.55 27.5,57.25 LED3.P$1 27.5,58 26.25,59.25 24,59.25 22.81,60.44 IC14.7 22.97,60.34 | 21.23,22.55 20.28,21.6 IC4.4 19.5,19.85 C4S.2 | 21.23,22.55 IC4.2 22.8,22.55 27.5,27.25 | 27.5,117.25 22.8,112.55 IC1.2 21.23,112.55 20.28,111.6 IC1.4 19.5,109.85 C1S.2 20.19,109.16 20.19,107.61 C1.2 20.45,106.2 19.25,105 19.25,99.25 | 42.5,27.25 37.8,22.55 IC8.2 36.23,22.55 | 42.5,27.25 LED8.P$1 | 36.23,22.55 35.28,21.6 IC8.4 34.5,19.85 C8S.2 35.19,19.15 35.19,17.95 35,17.75 35.4,17.35 C8.2 | LED7.P$1 42.5,57.25 37.8,52.55 IC7.2 36.23,52.55 35.28,51.6 IC7.4 34.5,49.85 C7S.2 35.19,49.15 35.19,47.6 C7.2 35.45,41.7 33,39.25 23,39.25 22,40.25 19,40.25 | LED6.P$1 42.5,87.25 37.8,82.55 IC6.2 36.23,82.55 35.28,81.6 IC6.4 34.5,79.85 C6S.2 35.17,79.17 | LED5.P$1 42.5,117.25 37.8,112.55 IC5.2 36.23,112.55 35.28,111.6 IC5.4 34.5,109.83 34.65,109.68 | 34.5,109.8 34.65,109.68 | 34.65,109.68 C5S.2 35.19,109.17 | 35.19,109.17 35.2,109.15 | 35.17,79.17 35.2,79.15 | LED10.P$1 85.5,117.25 80.8,112.55 IC9.2 79.23,112.55 | 79.23,112.55 78.28,111.6 IC9.4 77.5,110.05 C9S.2 78.2,109.35 C9.2 78.2,106.45 77.25,105.5 77.25,83.75 IC10.6 78.28,83.5 79.23,82.55 | IC9.6 78.28,113.5 79.23,112.55 | 79.23,82.55 78.28,81.6 IC10.4 77.5,79.85 C10S.2 78.2,79.15 C10.2 78.2,76.45 77.25,75.5 77.25,55.75 78.71,54.28 78.71,52.04
  Bottom 0.406: 79.23,82.55 IC10.2 80.81,82.55 85.5,87.24 LED9.P$1 | 19.25,99.25 19.25,85.75 20.75,84.25 20.75,83.03 21.23,82.55 | 21.23,52.55 20.75,53.03 20.75,54.25 19.25,55.75 19.25,69.25 | 21.23,22.55 20.75,23.03 20.75,24.25 19,26 19,40.25 | C3S.2 20.19,49.16 20.19,47.61 C3.2 20.45,46.2 19,44.75 19,40.25 | 78.84,22.16 78.28,21.6 IC12.4 77.5,19.85 C12S.2 78.2,19.15 C12.2 78.2,15.95 75.33,13.08 R3Q1.2 | 78.84,22.16 79.23,22.55 IC12.2 80.8,22.55 85.5,27.25 LED11.P$1 | 78.71,52.04 78.28,51.6 IC11.4 77.5,49.85 C11S.2 78.2,49.15 C11.2 78.2,45.55 79.25,44.5 79.25,42.75 81.53,40.47 | 78.71,52.04 79.23,52.55 IC11.2 80.8,52.55 85.5,57.25 LED12.P$1 82.56,60.44 IC17.7 | 19.25,99.25 34.25,99.25 35.45,100.45 C5.2 35.19,107.62 35.19,109.17 | 19.25,69.25 34.25,69.25 35.45,70.45 C6.2 35.17,77.62 35.17,79.17 | 85.25,87.25 LED9.P$1 | IC16.7 83.31,90.44 85.5,88.25 LED9.P$1 | IC20.1 56.01,31.01 53.5,28.5 53.5,25.25 52,23.75 C3P.2 49.8,22.95 46.5,26.25 43.5,26.25 42.5,27.25 | LED4.P$1 27.5,27.25 | 27.5,27.25 28.75,26 33.75,26 35.75,24 35.75,23.03 36.23,22.55 | U$1.P$9 92.25,44.75 91.5,44 91.5,42 89.97,40.47 IC18.10 81.53,40.47 | LED11.P$1 85.5,27.25 | U$22.P$6 93,24.25 91.25,26 86.75,26 85.5,27.25 LED11.P$1 | 95.75,95 95.75,85 94.25,83.5 | 95.75,95 95.75,119.5 93,122.25 76.75,122.25 71,116.5 71,91 70.61,90.61 IC15.13 69.42,90.72 | DSA.- 100.25,75 99.66,75.59 IC19.1 99.66,77.91 102.25,80.5 102.25,83.75 103,84.5 103,93.5 101.5,95 95.75,95 | C20.2 94.25,83.5 | 94.25,83.5 89.25,83.5 85.76,87 85.76,87.24 LED9.P$1 | 78.84,22.16 78.75,22.25 78.75,24 77.5,25.25 77.5,27.25 78.25,28 79.5,28 81.53,30.03 81.53,40.47
  Bottom 0.406: D1P.A 68.67,49.84 70,48.5 R3Q1.1
  Bottom 1.016: POWER.6 POWER.5 | POWER.4 POWER.3 | POWER.4 POWER.6 | POWER.6 POWER.8 POWER.7 62.41,44.41 67,49 D1P.A | POWER.4 57.34,31.2 IC20.1 59.69,31.01 C1P.- 60.5,30.2 C2P.2
  pour Bottom (isolate 0.61, no thermals): 0,119.25 121.68,119.25 121.68,9.25 0,9.25
INT/EXT_CLK
  Bottom 0.254: IC17.4 96.75,64.25 100.75,60.25 100.75,22 99,20.25 U$22.P$4
INT/EXT_RST
  Bottom 0.254: U$22.P$3 99.5,18.25 100,18.75 107,18.75 110,21.75 110,61.75 106.38,65.38 97.62,65.38 94,69 82.75,69 81.81,68.06 IC17.1
KEY1
  Bottom 0.406: IC1.1 R1L.1 20.9,115.6 18.5,118 11.75,118 5,111.25 5,101.5 7.25,99.25 10,99.25 12.46,96.79 IC13.13
KEY2
  Bottom 0.406: IC2.1 R2L.1 21.15,85.6 20.25,86.5 20.25,96 21.04,96.79 IC13.2
KEY3
  Bottom 0.406: IC3.1 R3L.1 20.9,55.6 20.25,56.25 20.25,66 21.04,66.79 IC14.2
KEY4
  Bottom 0.406: Z7.1 21.5,27.75 22,27.25 22.94,27.25 R4L.1 23,25.25 22,24.25 IC4.1
KEY5
  Bottom 0.406: IC5.1 R5L.1 33.75,115.6 33.25,116.1 33.25,118.5 32.75,119 11.25,119 4,111.75 4,101 7.58,97.42 Z8.1
KEY6
  Bottom 0.254: IC13.5 27.01,92.98 28.5,91.49 28.5,86.75 29.65,85.6 R6L.1
  Bottom 0.406: R6L.1 IC6.1
KEY7
  Bottom 0.254: IC14.5 27.27,62.98 28.52,61.73 28.52,56.73 29.65,55.6 R7L.1
  Bottom 0.406: IC7.1 R7L.1
KEY8
  Bottom 0.406: IC8.1 R8L.1 35.65,25.6 33.25,28 33.25,30.25 30.75,32.75 23.5,32.75 21.75,31 Z6.1
KEY11
  Bottom 0.406: IC11.1 R11L.2 78.65,55.6 78.25,56 78.25,62.5 78.73,62.98 IC17.5
MAN_CLK
  Bottom 0.406: IC16.4 78.75,94.25 78.25,93.75 78.25,86.25 78.9,85.6 R10L.2 IC10.1
MAN_RST
  Bottom 0.406: IC9.1 R9L.2 78.03,115.6 77.38,116.25 77.38,118.5 78.12,119.25 91,119.25 91.75,118.5 91.75,100.75 89.06,98.06 IC16.1
N$1
  Bottom 0.406: R1.1 101.45,85.68 | 101.28,86 R1.1 | DSA.+ 99.05,69.95 98.39,70.61 IC19.2 98.39,78.14 101.17,80.92 R1.1 | R1.1 101.75,86.33 101.75,92.95 100.78,93.93 97.78,93.93 96.79,92.94 96.79,84.31 97.11,83.98 IC19.6
N$2  (via drill 0.35)
  Bottom 0.406: IC10.3 80,79.85 C10S.1 82.7,79.55 TP11.P$1
  other vias: 85.5,76.75
N$3
  Bottom 0.406: IC19.7 98.39,85.69 R1.2 98.5,85.92 U$5.P$1
N$4
  Bottom 0.406: LED9.P$2 R10L.1
N$5  (via drill 0.35)
  Bottom 0.406: IC1.3 22,109.85 C1S.1 24.7,109.55 TP1.P$1
  other vias: 27.5,106.75
N$6  (via drill 0.35)
  Bottom 0.406: IC11.3 80,49.85 C11S.1 82.7,49.55 TP12.P$1
  other vias: 85.5,46.75
N$7
  Bottom 0.406: LED12.P$2 R11L.1
N$8  (via drill 0.35)
  Bottom 0.406: IC9.3 80,110.05 C9S.1 82.7,109.55 TP13.P$1
  other vias: 85.5,106.75
N$9
  Bottom 0.406: LED1.P$2 R1Q.2
N$10  (via drill 0.35)
  Bottom 0.406: IC5.3 37,109.85 C5S.1 39.7,109.55 TP5.P$1
  other vias: 42.5,106.75
N$11
  Bottom 0.406: IC16.5 82.73,92.98 83.5,93.75 U$26.P$1
N$12
  Bottom 0.406: LED10.P$2 R9L.1
N$13
  Bottom 0.406: LED1.P$3 R1L.2
N$14
  Bottom 0.406: LED2.P$2 30.5,87.5 31,88 32.51,88 R2Q.2
N$15
  Bottom 0.406: LED9.P$3 R10Q.2
N$16
  Bottom 0.406: LED2.P$3 R2L.2
N$17  (via drill 0.35)
  Bottom 0.406: IC2.3 22,79.85 C2S.1 24.7,79.55 TP2.P$1
  other vias: 27.5,76.75
N$18
  Bottom 0.406: IC16.2 91.17,96.79 U$23.P$1
N$19
  Bottom 0.406: LED3.P$2 32.75,57.5 R3Q.2
N$20
  Bottom 0.406: R3L.2 LED3.P$3
N$21  (via drill 0.35)
  Bottom 0.406: IC12.3 80,19.85 C12S.1 82.7,19.55 TP10.P$1
  other vias: 85.5,16.75
N$22
  Bottom 0.406: LED4.P$2 R4Q.2
N$23
  Bottom 0.406: R12L.1 82.75,25.75 83.5,26.5 83.5,27.46 LED11.P$2
N$24
  Bottom 0.406: R4L.2 24.79,29.21 25.46,28.54 LED4.P$3
N$25
  Bottom 0.406: R5Q.2 LED5.P$2
N$26  (via drill 0.35)
  Bottom 0.406: IC3.3 22,49.85 C3S.1 24.7,49.55 TP3.P$1
  other vias: 27.5,46.75
N$27
  Bottom 0.406: LED5.P$3 R5L.2
N$28
  Bottom 0.406: R6Q.1 LED6.P$2
N$29
  Bottom 0.406: LED6.P$3 R6L.2
N$30
  Bottom 0.406: R7Q.1 LED7.P$2
N$31  (via drill 0.35)
  Bottom 0.406: IC4.3 22,19.85 C4S.1 24.7,19.55 TP4.P$1
  other vias: 27.5,16.75
N$32
  Bottom 0.406: LED7.P$3 R7L.2
N$33
  Bottom 0.406: LED8.P$2 R8Q.2
N$34
  Bottom 0.406: IC17.3 88.77,65.52 89.5,66.25 U$24.P$1
N$35
  Bottom 0.406: 80.36,61.75 IC17.6 83.04,61.71 84.75,60 U$25.P$1
N$37
  Bottom 0.406: IC17.2 85.22,66.79 Z10.2
N$42
  Bottom 0.406: LED8.P$3 R8L.2
N$43
  Bottom 0.406: IC18.14 90.89,35.39 92.25,36.75 U$1.P$5
N$44
  Bottom 0.406: IC18.13 90.66,36.66 92.75,38.75 U$1.P$6
N$45
  Bottom 0.406: IC18.12 90.42,37.92 93.25,40.75 U$1.P$7
N$46
  Bottom 0.406: IC18.11 87.96,39.25 90.25,39.25 92.5,41.5 92.5,42.25 93,42.75 U$1.P$8
N$47
  Bottom 0.406: IC18.15 91.25,34.11 91.89,34.75 U$1.P$4
N$48
  Bottom 0.406: IC18.16 95.98,32.84 U$1.P$3
N$49  (via drill 0.35)
  Bottom 0.406: IC6.3 37,79.85 C6S.1 39.7,79.55 TP6.P$1
  other vias: 42.5,76.75
N$50
  Bottom 0.406: IC18.17 92,31.58 92.83,30.75 U$1.P$2
N$51
  Bottom 0.406: IC18.18 91.44,30.3 93,28.75 U$1.P$1
N$52
  Bottom 0.406: R9Q.1 LED10.P$3
N$53
  Bottom 1.016: F1.2 63.35,30.95 C1P.+ 62.5,30.2 C2P.1 62.5,26.5 61.5,25.5 58.09,25.5 IC20.3
N$54  (via drill 0.35)
  Bottom 0.406: IC7.3 37,49.85 C7S.1 39.7,49.55 TP7.P$1
  other vias: 42.5,46.75
N$55
  Bottom 0.406: IC13.11 U$7.P$1
N$56
  Bottom 0.406: IC13.3 24.83,95.52 U$8.P$1
N$59  (via drill 0.35)
  Bottom 0.406: IC8.3 37,19.85 C8S.1 39.7,19.55 TP8.P$1
  other vias: 42.5,16.75
N$60
  Bottom 0.406: IC14.3 24.82,65.52 U$9.P$1
N$61
  Bottom 0.406: IC14.11 U$10.P$1
N$62
  Bottom 0.406: IC13.8 13.44,90.44 U$11.P$1
N$63
  Bottom 0.406: IC13.6 25.46,91.71 25.5,91.75 U$12.P$1
N$64
  Bottom 0.406: IC14.6 24.89,61.71 U$13.P$1
N$65
  Bottom 0.406: IC14.8 13.94,60.44 U$14.P$1
N$67
  Bottom 0.406: Z4.2 13.3,38.25 5.25,46.3 5.25,55 11.96,61.71 IC14.9
N$68
  Bottom 0.406: IC14.10 15.23,62.98 14.75,62.5 11.5,62.5 4.25,55.25 4.25,45.75 13.75,36.25 17,36.25 17.5,35.75 17.5,31.25 17.25,31 Z6.2
N$69
  Bottom 0.406: IC14.12 15.23,65.52 14.75,66 10.25,66 3.25,59 3.25,45 14,34.25 Z5.2
N$70
  Bottom 0.406: IC14.13 9.54,66.79 2.25,59.5 2.25,44.5 14,32.75 14,28.5 14.75,27.75 Z7.2
N$71
  Bottom 0.406: IC5.5 IC5.6 34,113.5 33.3,112.8 33.3,107.75 33.3,107.6 | Z1.1 20.92,100.5 32.55,100.5 33.3,101.25 33.3,107.6 | C5.1 33.3,107.6
N$72
  Bottom 0.406: IC6.5 IC6.6 34,83.5 33.3,82.75 33.3,77.5 | Z2.1 20.92,70.5 32.5,70.5 33.3,71.25 33.3,77.5 | C6.1 33.4,77.5 33.3,77.5
N$73
  Bottom 0.406: IC7.5 IC7.6 34,53.5 33.3,52.75 33.3,47.75 33.3,47.6 | Z3.1 21.75,42.25 23.5,40.5 32,40.5 33.3,41.75 33.3,47.6 | C7.1 33.3,47.6
N$74
  Bottom 0.406: IC13.10 14.98,92.98 14.5,92.5 9.83,92.5 8.75,93.58 Z8.2
N$75
  Bottom 0.406: IC18.1 78.04,30.25 76.75,30.25 75.5,29 75.5,26.5 74,25 U$2.P$1
N$76
  Bottom 0.406: IC18.2 76.58,31.58 74.5,29.5 74.5,28.25 74,27.75 U$15.P$1
N$77
  Bottom 0.406: IC18.3 76.34,32.84 74,30.5 U$16.P$1
N$78
  Bottom 0.406: IC18.4 76.11,34.11 75.25,33.25 U$17.P$1
N$79
  Bottom 0.406: IC18.5 76.11,35.39 75.25,36.25 U$18.P$1
N$80
  Bottom 0.406: IC18.6 76.34,36.66 74,39 U$19.P$1
N$81
  Bottom 0.406: IC18.7 76.58,37.92 74.5,40 74.5,41.25 74,41.75 U$20.P$1
N$82
  Bottom 0.406: IC18.8 76.81,39.2 75.5,40.5 75.5,43 74,44.5 U$21.P$1
POLY_EXT_1
  pour Bottom (isolate 0.61, no thermals): 0,0 121.68,0 121.68,7 0,7
  pour Bottom (isolate 0.61): 0,121.5 121.68,121.5 121.68,128.5 0,128.5
RS_EXT_ENABLE
  Bottom 0.254: R12L.2 79.3,26.55 81.5,28.75 90.75,28.75 92.25,27.25 98.75,27.25 99.75,28.25 99.75,59.75 96.83,62.67 Z10.1
  Bottom 0.406: R12L.2 79.3,24.7 80,24 IC12.1
RST_SEL
  Bottom 0.254: U$4.P$1 68.73,102.23 70,103.5 70,117 76.25,123.25 93.25,123.25 97,119.5 97,97.25 98,96.25 101.75,96.25 104.25,93.75 112,86 112,10.25 110.25,8.5 102.25,8.5 99.75,11 99.75,13.5 99,14.25 U$22.P$1
RST_SUM
  Bottom 0.254: R9Q.2 93.17,119.08 92,120.25 77.5,120.25 73,115.75 73,90.25 70.83,88.08 IC15.15
  Bottom 0.406: R9Q.2 93.75,116.92 93.75,96.25 93.02,95.52 IC16.3
VCC
  Bottom 0.305: IC1.5 IC1.6
  Bottom 0.406: IC2.5 IC2.6 18.3,83.5 | IC3.5 IC3.6 18.3,53.5 | IC4.5 IC4.6 18.25,23.5 | IC1.6 19,113.5 18.3,112.8 18.3,107.6 C1.1 18.25,107.05 18.25,100.75 | IC8.5 IC8.6 34,23.5 33.3,22.75 33.3,17.65 | 18.3,83.5 18.3,98.03 | IC9.5 77.45,112.5 76.75,112.5 76.3,112.05 C9.1 76.3,98 | 76.3,98 76.3,86.75 | 76.3,86.75 76.3,82.5 | 76.3,82.5 C10.1 76.3,70.75 | IC10.5 77.45,82.5 76.3,82.5 | IC13.14 18.27,98.06 | 18.27,98.06 18.3,98.03 | C2.1 18.55,77.24 18.3,77.49 | 18.3,53.5 18.3,68 | IC14.14 18.24,68.06 18.3,68 | 18.27,98.06 18.3,98.09 | 18.3,83.5 18.3,77.49 | 18.3,68 18.3,70.75 | 18.3,70.75 18.3,77.49 | 18.3,47.5 18.3,53.5 | 76.3,70.75 76.3,68.06 | 76.3,68.06 76.3,53.45 | 76.3,53.45 C11.1 76.3,44.95 78.1,43.15 IC18.9 79.53,40.47 80.25,39.75 80.25,30 79.25,29 77.25,29 76.5,28.25 76.5,24.75 76.3,24.55 76.3,23.5 | 76.3,53.45 76.34,53.5 IC11.6 IC11.5 | 76.3,23.5 C12.1 76.3,16.05 74.75,14.5 52,14.5 | IC17.14 76.3,68.06 | IC16.14 76.24,98.06 76.3,98 | 18.8,17.6 C4.1 | 18.25,23.5 18.25,17.65 C4.1 | 69.84,86.91 IC15.16 76.25,86.81 76.3,86.75 | IC20.2 55.73,28.73 54.75,27.75 54.75,22.75 53.05,21.05 C3P.1 52,14.5 | C4.1 18.25,17.05 18.25,12.5 20.25,10.5 33.3,10.5 | 33.3,10.5 48,10.5 52,14.5 | 18.25,100.75 Z1.2 | 18.25,100.75 18.3,100.7 18.3,98.03 | Z2.2 18.3,70.75 | 76.3,23.5 IC12.6 IC12.5 | 33.3,17.65 33.3,10.5 | C8.1 33.3,17.65 | C3.1 18.45,47.35 18.3,47.5 | 18.3,47.5 18.3,46.8 18.25,46.75 18.25,42.25 | 18.25,42.25 18.25,23.5 | Z3.2 18.25,42.25 | Z9.2 76.3,70.75

### Text on the board
tPlace: STEP | 1 | 5 | 4 | 5 | 3 | 6 | 2 | 7 | reset | 1 | 8 | SPEED | 2 | 6 | pulse | 1 | 5 | 3 | 7 | 2 | 6 | 3 | 7 | clock / control | 4 | 8 | 4 | 8 | CLK / IN | CV | CLK / OUT | RST | reset / control
bPlace: CH2 | CH1 | CH6 | CH5 | CH3 | CH4 | CH7 | CH8 | CH1 | CH2 | CH3 | CH4 | CH5 | CH6 | CH7 | CH8